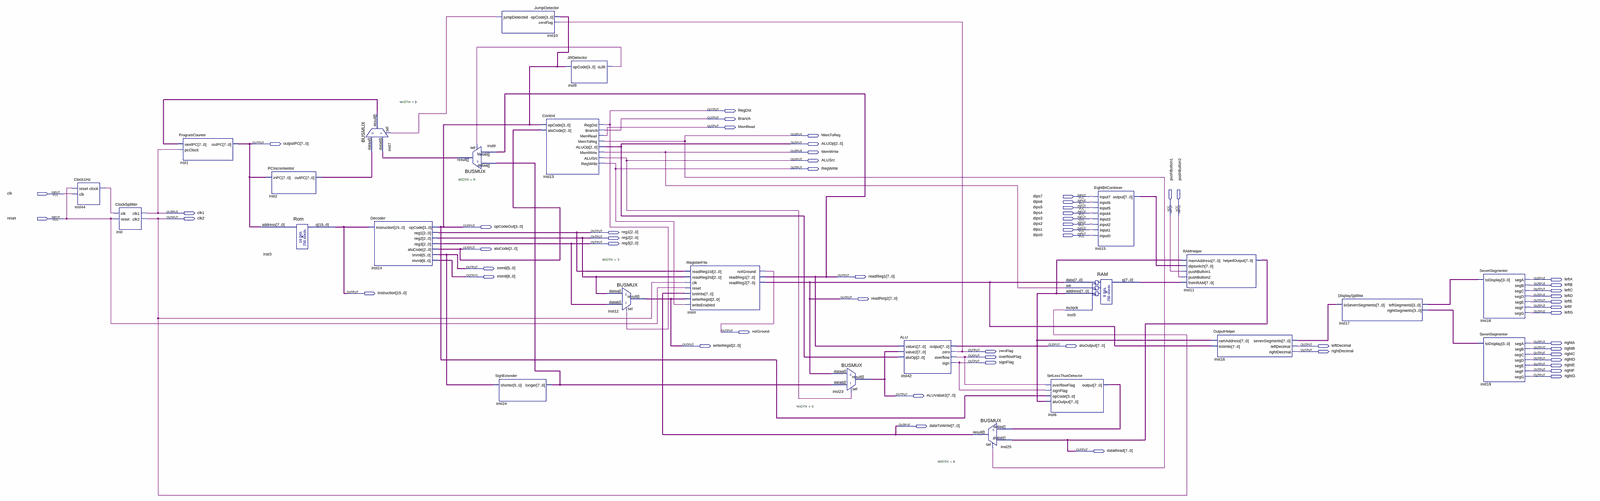
[diagram p0: schematic sheet, whole]
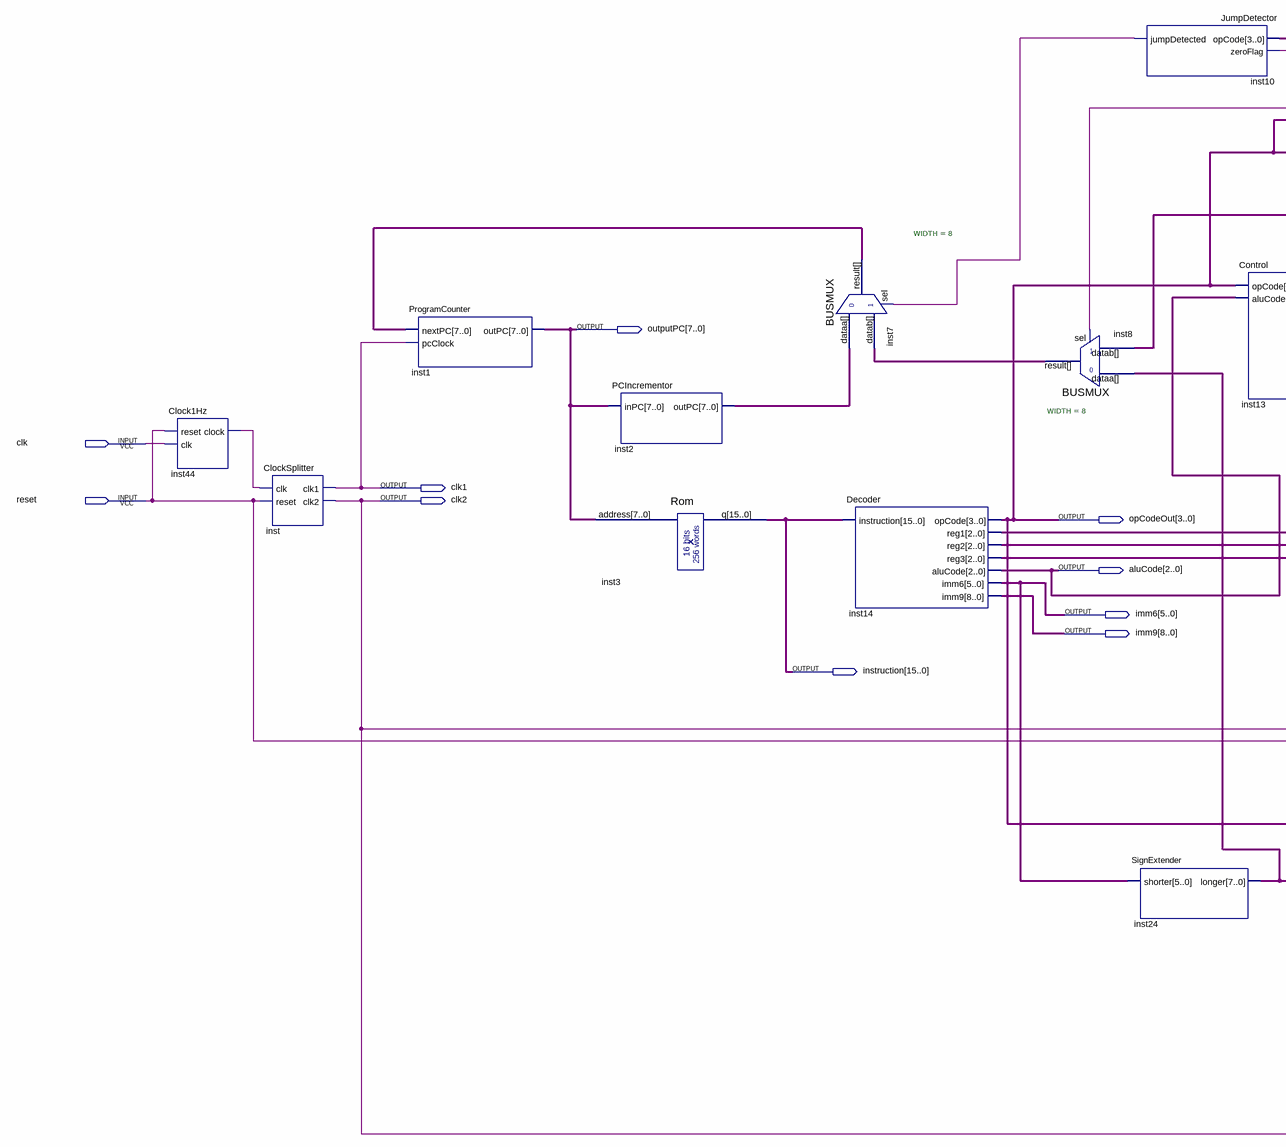
[diagram p1: schematic sheet, left part]
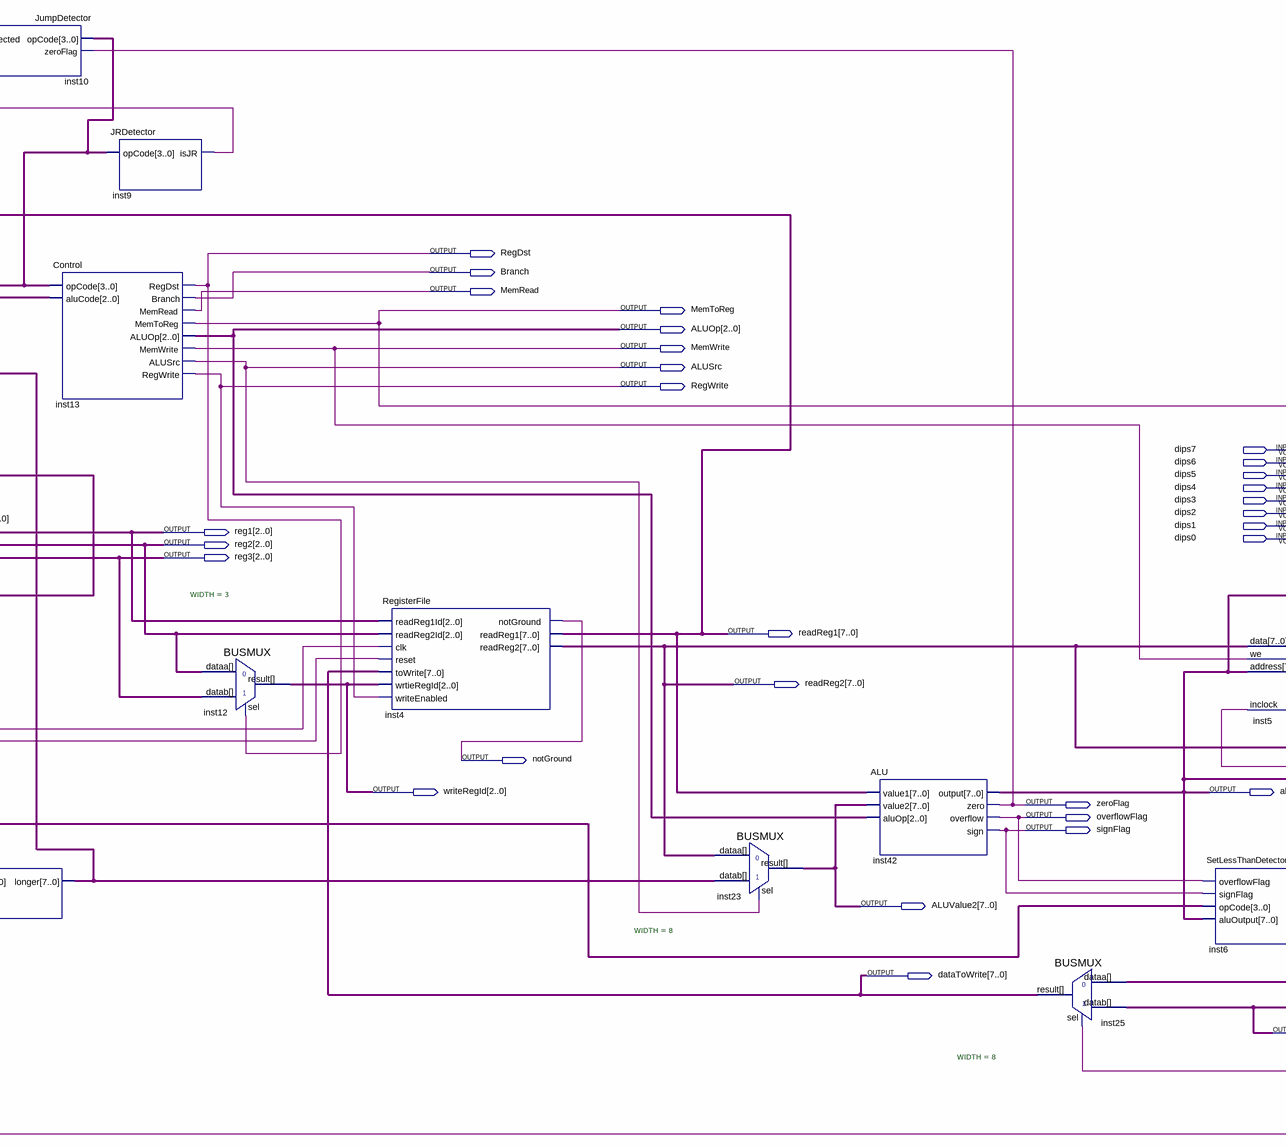
[diagram p2: schematic sheet, centre part]
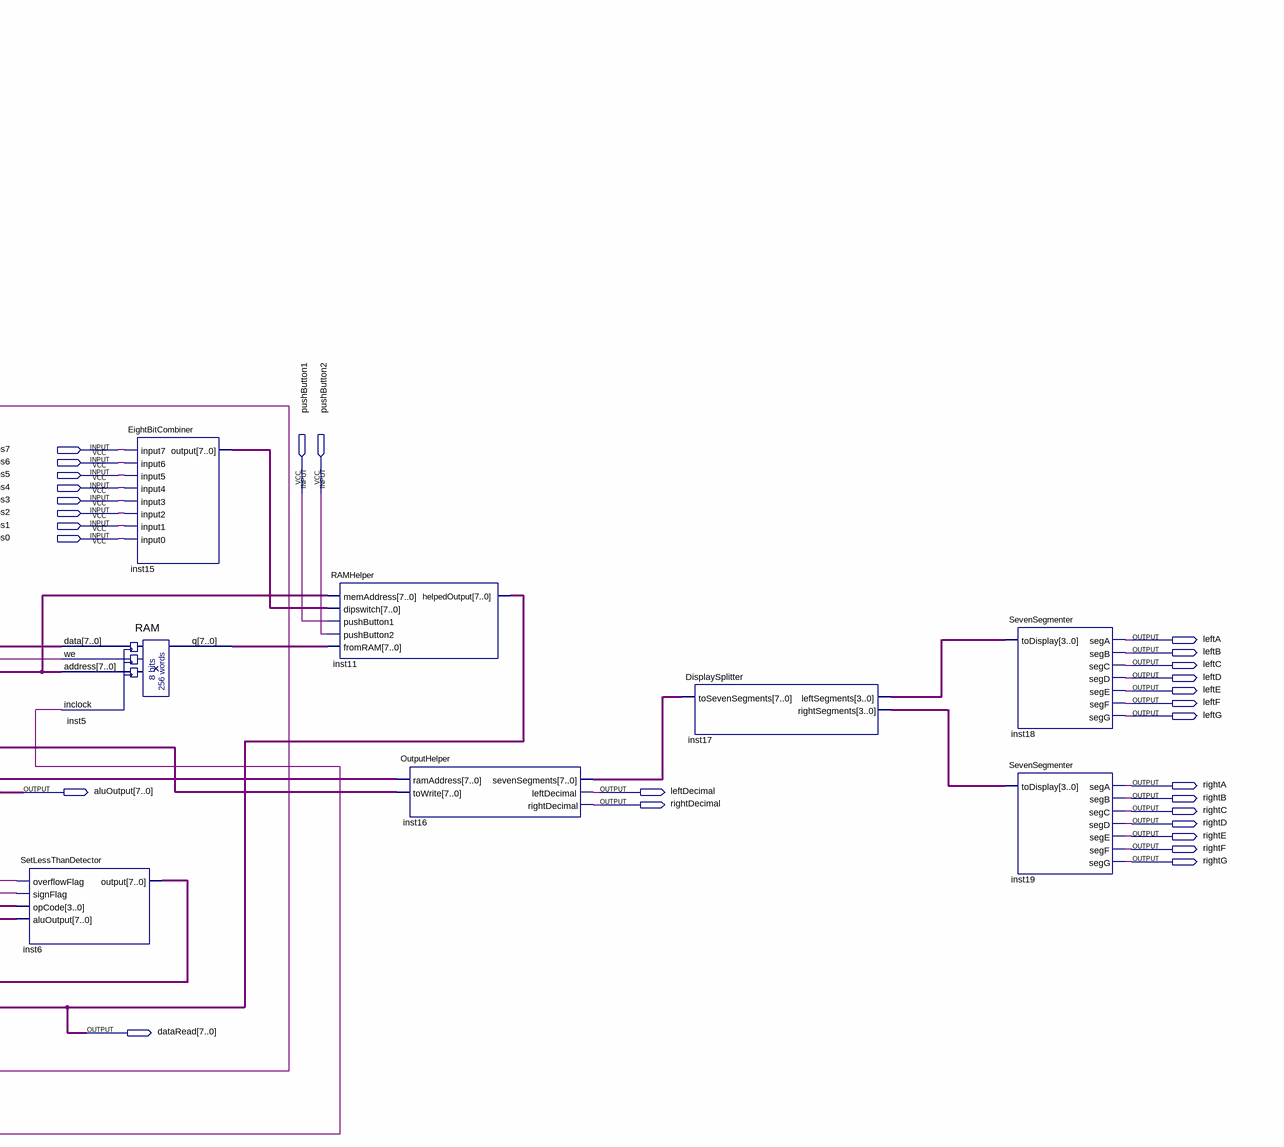
[diagram p3: schematic sheet, right part]
// Quartus schematic Processor.bdf as structural Verilog: 25 symbols, 58 pins
module Processor (
  input  clk,
  input  dips7,
  input  dips6,
  input  dips5,
  input  dips4,
  input  pushButton1,
  input  pushButton2,
  input  reset,
  input  dips3,
  input  dips2,
  input  dips1,
  input  dips0,
  output RegDst,
  output Branch,
  output MemRead,
  output MemToReg,
  output [7:0] outputPC,
  output [2:0] ALUOp,
  output MemWrite,
  output ALUSrc,
  output RegWrite,
  output clk1,
  output clk2,
  output [3:0] opCodeOut,
  output [2:0] reg1,
  output [2:0] reg2,
  output [2:0] reg3,
  output [2:0] aluCode,
  output [5:0] imm6,
  output [8:0] imm9,
  output [7:0] readReg1,
  output leftA,
  output leftB,
  output leftC,
  output [15:0] instruction,
  output leftD,
  output [7:0] readReg2,
  output leftE,
  output leftF,
  output leftG,
  output notGround,
  output rightA,
  output [2:0] writeRegId,
  output [7:0] aluOutput,
  output leftDecimal,
  output rightB,
  output zeroFlag,
  output rightDecimal,
  output rightC,
  output overflowFlag,
  output rightD,
  output signFlag,
  output rightE,
  output rightF,
  output rightG,
  output [7:0] ALUValue2,
  output [7:0] dataToWrite,
  output [7:0] dataRead
);

  wire inst9_isjr, inst10_jumpdetected, inst44_clock;
  wire [3:0] inst17_leftsegments, inst17_rightsegments;
  wire [7:0] inst2_outpc, inst5_q, inst6_output, inst7_result, inst8_result, inst15_output,
       inst16_sevensegments, inst24_longer;

  Clock1Hz inst44 (.reset(reset), .clk(clk), .clock(inst44_clock));
  ClockSplitter inst (.clk(inst44_clock), .reset(reset), .clk1(clk1), .clk2(clk2));
  ProgramCounter inst1 (.nextPC(inst7_result), .pcClock(clk1), .outPC(outputPC));
  PCIncrementor inst2 (.inPC(outputPC), .outPC(inst2_outpc));
  Rom inst3 (.address(outputPC), .q(instruction));
  BUSMUX #(.WIDTH(8)) inst7 (
    .datab(inst8_result), .sel(inst10_jumpdetected), .dataa(inst2_outpc), .result(inst7_result));
  Decoder inst14 (
    .instruction(instruction), .opCode(opCodeOut), .reg1(reg1), .reg2(reg2), .reg3(reg3), .aluCode(aluCode),
    .imm6(imm6), .imm9(imm9));
  BUSMUX #(.WIDTH(8)) inst8 (.datab(readReg1), .sel(inst9_isjr), .dataa(inst24_longer), .result(inst8_result));
  JumpDetector inst10 (.opCode(opCodeOut), .zeroFlag(zeroFlag), .jumpDetected(inst10_jumpdetected));
  SignExtender inst24 (.shorter(imm6), .longer(inst24_longer));
  Control inst13 (
    .opCode(opCodeOut), .aluCode(aluCode), .RegDst(RegDst), .Branch(Branch), .MemRead(MemRead),
    .MemToReg(MemToReg), .ALUOp(ALUOp), .MemWrite(MemWrite), .ALUSrc(ALUSrc), .RegWrite(RegWrite));
  JRDetector inst9 (.opCode(opCodeOut), .isJR(inst9_isjr));
  BUSMUX #(.WIDTH(3)) inst12 (.datab(reg3), .sel(RegDst), .dataa(reg2), .result(writeRegId));
  RegisterFile inst4 (
    .readReg1Id(reg1), .readReg2Id(reg2), .clk(clk2), .reset(reset), .toWrite(dataToWrite),
    .wrtieRegId(writeRegId), .writeEnabled(RegWrite), .notGround(notGround), .readReg1(readReg1),
    .readReg2(readReg2));
  BUSMUX #(.WIDTH(8)) inst23 (.datab(inst24_longer), .sel(ALUSrc), .dataa(readReg2), .result(ALUValue2));
  ALU inst42 (
    .value1(readReg1), .value2(ALUValue2), .aluOp(ALUOp), .\output (aluOutput), .zero(zeroFlag),
    .overflow(overflowFlag), .sign(signFlag));
  BUSMUX #(.WIDTH(8)) inst25 (.datab(dataRead), .sel(MemToReg), .dataa(inst6_output), .result(dataToWrite));
  SetLessThanDetector inst6 (
    .overflowFlag(overflowFlag), .signFlag(signFlag), .opCode(opCodeOut), .aluOutput(aluOutput),
    .\output (inst6_output));
  RAM inst5 (.data(readReg2), .we(MemWrite), .address(aluOutput), .inclock(clk2), .q(inst5_q));
  EightBitCombiner inst15 (
    .input7(dips7), .input6(dips6), .input5(dips5), .input4(dips4), .input3(dips3), .input2(dips2),
    .input1(dips1), .input0(dips0), .\output (inst15_output));
  RAMHelper inst11 (
    .memAddress(aluOutput), .dipswitch(inst15_output), .pushButton1(pushButton1), .pushButton2(pushButton2),
    .fromRAM(inst5_q), .helpedOutput(dataRead));
  OutputHelper inst16 (
    .ramAddress(aluOutput), .toWrite(readReg2), .sevenSegments(inst16_sevensegments),
    .leftDecimal(leftDecimal), .rightDecimal(rightDecimal));
  DisplaySplitter inst17 (
    .toSevenSegments(inst16_sevensegments), .leftSegments(inst17_leftsegments),
    .rightSegments(inst17_rightsegments));
  SevenSegmenter inst18 (
    .toDisplay(inst17_leftsegments), .segA(leftA), .segB(leftB), .segC(leftC), .segD(leftD), .segE(leftE),
    .segF(leftF), .segG(leftG));
  SevenSegmenter inst19 (
    .toDisplay(inst17_rightsegments), .segA(rightA), .segB(rightB), .segC(rightC), .segD(rightD),
    .segE(rightE), .segF(rightF), .segG(rightG));
endmodule
